# Altium schematic sheet 12V_9V_Power_Stage.SchDoc (part 3 of 4)
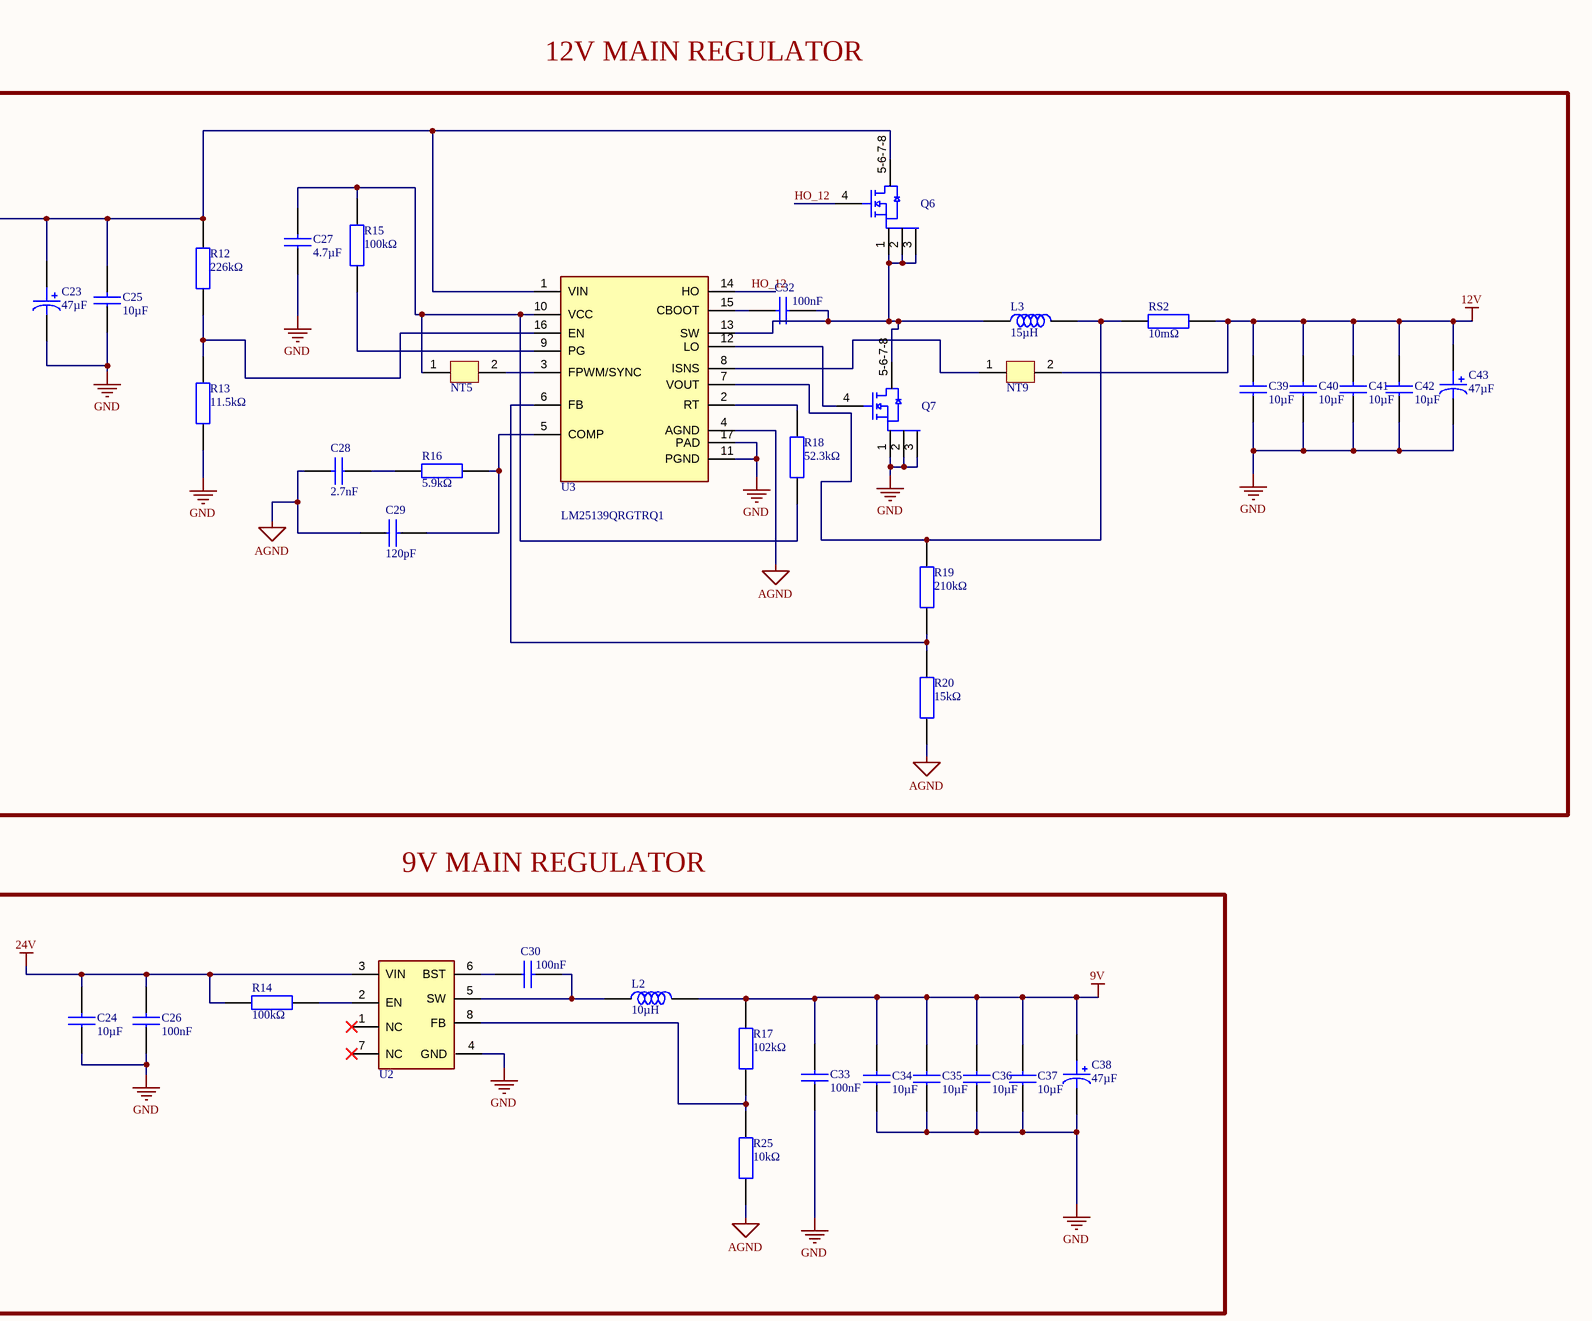
[diagram p3: 12V_9V_Power_Stage.SchDoc, right]

## Library data of the parts (continued)
R17 = CRCW0402102KFKED: 63mW Thick Film Resistors 75V ±1% ±100ppm/℃ 102kΩ 0402 Chip Resistor - Surface Mount ROHS; Manufacturer: Vishay; Temperature Coefficient: 100ppm/°C; Voltage Rating: 50V; Supplier: Farnell; Supplier Part Number: CRCW0402102KFKED; Manufacturer Part Number: CRCW0402102KFKED; RoHS: Compliant; Category: Chip SMD Resistors; Stock: 8240; Pricing: 10=0,0198, 100=0,0144, 500=0,0116, 2500=0,0096, 5000=0,0093, 10000=0,0089 (EUR); Case/Package: 0402; Case Code (Imperial): 0402; China RoHS: Non-Compliant; Composition: Thick Film; Contact Plating: Tin; Country of Origin: Israel, Taiwan; Depth: 500µm; Export Control Classification Number (ECCN) Code: EAR99; Features: Automotive AEC-Q200; Height: 350µm; Harmonized Tariff Schedule (HTS) Code: 8533.21.00.30; Introduction Date: 2005-03-24; Lead Free: Lead Free; Length: 1mm; Lifecycle Status: Production; Max Operating Temperature: 155°C; Max Power Dissipation: 63mW; Military Standard: Not; Min Operating Temperature: -55°C; Mounting Technology: Surface Mount; Pins: 2; Number of Terminals: 2; Number of Terminations: 2; Packaging: Cut Tape; Power Rating: 63mW; Radiation Hardening: No; Ratings: AEC-Q200; REACH SVHC: Yes; Schedule B: 8533210045, 8533210045|8533210045, 8533210045|8533210045|8533210045, 8533210045|8533210045|8533210045|8533210045; Termination: SMD/SMT; Tolerance: 1%; Voltage Rating (DC): 50V; Weight: 652.039032µg; Width: 500µm; Working Voltage: 50V; ComponentLink1URL: https://datasheet.octopart.com:443/CRCW0402102KFKED-Vishay-datasheet-175423584.pdf?src-supplier=IHS; ComponentLink1Description: https://datasheet.octopart.com:443/CRCW0402102KFKED-Vishay-datasheet-175423584.pdf?src-supplier=IHS; ComponentLink2URL: https://datasheet.octopart.com:443/CRCW0402102KFKED-Vishay-datasheet-190005712.pdf?src-supplier=TME; ComponentLink2Description: https://datasheet.octopart.com:443/CRCW0402102KFKED-Vishay-datasheet-190005712.pdf?src-supplier=TME; ComponentLink3URL: https://datasheet.octopart.com:443/CRCW0402102KFKED-Vishay-datasheet-66077789.pdf?src-supplier=Newark; ComponentLink3Description: https://datasheet.octopart.com:443/CRCW0402102KFKED-Vishay-datasheet-66077789.pdf?src-supplier=Newark; ComponentLink4URL: https://datasheet.octopart.com:443/CRCW0402102KFKED-Vishay-datasheet-11761042.pdf?src-supplier=Newark; ComponentLink4Description: https://datasheet.octopart.com:443/CRCW0402102KFKED-Vishay-datasheet-11761042.pdf?src-supplier=Newark; ComponentLink5URL: https://datasheet.octopart.com:443/CRCW0402102KFKED-Vishay-datasheet-11516975.pdf?src-supplier=Newark; ComponentLink5Description: https://datasheet.octopart.com:443/CRCW0402102KFKED-Vishay-datasheet-11516975.pdf?src-supplier=Newark; ComponentLink6URL: https://datasheet.octopart.com:443/CRCW0402102KFKED.-Vishay-datasheet-183883877.pdf?src-supplier=Newark; ComponentLink6Description: https://datasheet.octopart.com:443/CRCW0402102KFKED.-Vishay-datasheet-183883877.pdf?src-supplier=Newark; ComponentLink7URL: https://datasheet.octopart.com:443/CRCW0402102KFKED-Vishay-datasheet-159614168.pdf?src-supplier=Newark; ComponentLink7Description: https://datasheet.octopart.com:443/CRCW0402102KFKED-Vishay-datasheet-159614168.pdf?src-supplier=Newark; ComponentLink8URL: https://datasheet.octopart.com:443/CRCW0402102KFKED-Vishay-datasheet-41302739.pdf?src-supplier=Newark; ComponentLink8Description: https://datasheet.octopart.com:443/CRCW0402102KFKED-Vishay-datasheet-41302739.pdf?src-supplier=Newark; ComponentLink9URL: https://datasheet.octopart.com:443/CRCW0402102KFKED-Vishay-datasheet-33013972.pdf?src-supplier=Newark; ComponentLink9Description: https://datasheet.octopart.com:443/CRCW0402102KFKED-Vishay-datasheet-33013972.pdf?src-supplier=Newark; ComponentLink10URL: https://datasheet.octopart.com:443/CRCW0402102KFKED-Vishay-datasheet-21226360.pdf?src-supplier=Newark; ComponentLink10Description: https://datasheet.octopart.com:443/CRCW0402102KFKED-Vishay-datasheet-21226360.pdf?src-supplier=Newark; ComponentLink11URL: https://datasheet.octopart.com:443/CRCW0402102KFKED-Vishay-datasheet-62317936.pdf?src-supplier=Farnell; ComponentLink11Description: https://datasheet.octopart.com:443/CRCW0402102KFKED-Vishay-datasheet-62317936.pdf?src-supplier=Farnell; ComponentLink12URL: https://datasheet.octopart.com:443/CRCW0402102KFKED.-Vishay-datasheet-83961561.pdf?src-supplier=Farnell; ComponentLink12Description: https://datasheet.octopart.com:443/CRCW0402102KFKED.-Vishay-datasheet-83961561.pdf?src-supplier=Farnell; ComponentLink13URL: https://datasheet.octopart.com:443/CRCW0402102KFKED-Vishay-datasheet-14722531.pdf?src-supplier=element14+APAC; ComponentLink13Description: https://datasheet.octopart.com:443/CRCW0402102KFKED-Vishay-datasheet-14722531.pdf?src-supplier=element14+APAC; ComponentLink14URL: https://datasheet.octopart.com:443/CRCW0402102KFKED-Vishay-datasheet-62316122.pdf?src-supplier=Future+Electronics; ComponentLink14Description: https://datasheet.octopart.com:443/CRCW0402102KFKED-Vishay-datasheet-62316122.pdf?src-supplier=Future+Electronics; ComponentLink15URL: https://datasheet.octopart.com:443/CRCW0402102KFKED-Vishay-datasheet-12519820.pdf?src-supplier=Future+Electronics; ComponentLink15Description: https://datasheet.octopart.com:443/CRCW0402102KFKED-Vishay-datasheet-12519820.pdf?src-supplier=Future+Electronics; ComponentLink16URL: https://datasheet.octopart.com:443/CRCW0402102KFKED-Vishay-Dale-datasheet-47688880.pdf?src-supplier=RS+(Formerly+Allied+Electronics); ComponentLink16Description: https://datasheet.octopart.com:443/CRCW0402102KFKED-Vishay-Dale-datasheet-47688880.pdf?src-supplier=RS+(Formerly+Allied+Electronics); ComponentLink17URL: https://datasheet.octopart.com:443/CRCW0402102KFKED-Vishay-datasheet-12001583.pdf?src-supplier=RS+(Formerly+Allied+Electronics); ComponentLink17Description: https://datasheet.octopart.com:443/CRCW0402102KFKED-Vishay-datasheet-12001583.pdf?src-supplier=RS+(Formerly+Allied+Electronics); ComponentLink18URL: https://datasheet.octopart.com:443/CRCW0402102KFKED-Vishay-datasheet-5306405.pdf?src-supplier=RS+(Formerly+Allied+Electronics); ComponentLink18Description: https://datasheet.octopart.com:443/CRCW0402102KFKED-Vishay-datasheet-5306405.pdf?src-supplier=RS+(Formerly+Allied+Electronics); ComponentLink19URL: https://datasheet.octopart.com/D-CRCW-e3-Standard-Thick-Film-Chip-Resistors-Vishay-datasheet-family-64.pdf; ComponentLink19Description: https://datasheet.octopart.com/D-CRCW-e3-Standard-Thick-Film-Chip-Resistors-Vishay-datasheet-family-64.pdf; ComponentLink20URL: https://datasheet.octopart.com:443/CRCW0402102KFKED-Vishay-datasheet-11540273.pdf?src-supplier=Arrow+Electronics; ComponentLink20Description: https://datasheet.octopart.com:443/CRCW0402102KFKED-Vishay-datasheet-11540273.pdf?src-supplier=Arrow+Electronics; ComponentLink21URL: https://datasheet.octopart.com:443/CRCW0402102KFKED-Vishay-datasheet-8445837.pdf?src-supplier=element14; ComponentLink21Description: https://datasheet.octopart.com:443/CRCW0402102KFKED-Vishay-datasheet-8445837.pdf?src-supplier=element14; ComponentLink22URL: https://datasheet.octopart.com:443/CRCW0402102KFKED-Vishay-datasheet-5377255.pdf?src-supplier=Garrett; ComponentLink22Description: https://datasheet.octopart.com:443/CRCW0402102KFKED-Vishay-datasheet-5377255.pdf?src-supplier=Garrett; ComponentLink23URL: https://datasheet.octopart.com:443/CRCW0402102KFKED-Vishay-datasheet-148188.pdf?src-supplier=Garrett; ComponentLink23Description: https://datasheet.octopart.com:443/CRCW0402102KFKED-Vishay-datasheet-148188.pdf?src-supplier=Garrett; ComponentLink24URL: https://datasheet.octopart.com:443/CRCW0402102KFKED-Vishay-datasheet-42367.pdf?src-supplier=Garrett; ComponentLink24Description: https://datasheet.octopart.com:443/CRCW0402102KFKED-Vishay-datasheet-42367.pdf?src-supplier=Garrett; ComponentLink25URL: http://sigma.octopart.com:80/rohs_certificate/D-CRCW-e3-Standard-Thick-Film-Chip-Resistors-Vishay-family-102.pdf?src-supplier=Compliance+Statements; ComponentLink25Description: http://sigma.octopart.com:80/rohs_certificate/D-CRCW-e3-Standard-Thick-Film-Chip-Resistors-Vishay-family-102.pdf?src-supplier=Compliance+Statements
R18 = CRCW060352K3FKEA: 100mW Thick Film Resistors 75V ±1% ±100ppm/℃ 52.3kΩ 0603 Chip Resistor - Surface Mount ROHS; Manufacturer: Vishay; Temperature Coefficient: 100ppm/°C; Supplier: Farnell; Supplier Part Number: CRCW060352K3FKEA; Manufacturer Part Number: CRCW060352K3FKEA; RoHS: Compliant; Category: Chip SMD Resistors; Stock: 150000; Pricing: 5000=0,0098 (EUR); Case/Package: 0603; Case Code (Imperial): 0603; China RoHS: Non-Compliant; Composition: Thick Film; Contact Plating: Tin; Country of Origin: Israel, Taiwan; Depth: 850µm; Export Control Classification Number (ECCN) Code: EAR99; Features: Automotive AEC-Q200; Height: 450µm; Harmonized Tariff Schedule (HTS) Code: 8533.21.00.30; Introduction Date: 2005-02-16; Lead Free: Lead Free; Length: 1.55mm; Lifecycle Status: Production; Max Operating Temperature: 155°C; Max Power Dissipation: 100mW; Military Standard: Not; Min Operating Temperature: -55°C; Mounting Technology: Surface Mount; Pins: 2; Number of Terminals: 2; Number of Terminations: 2; Packaging: Cut Tape; Power Rating: 100mW; Radiation Hardening: No; Ratings: AEC-Q200; REACH SVHC: Yes; Schedule B: 8533210045, 8533210045|8533210045, 8533210045|8533210045|8533210045, 8533210045|8533210045|8533210045|8533210045; Termination: SMD/SMT; Tolerance: 1%; Voltage Rating: 75V; Weight: 2.012816mg; Width: 850µm; Working Voltage: 75V; ComponentLink1URL: https://datasheet.octopart.com:443/CRCW060352K3FKEA-Vishay-datasheet-175423584.pdf?src-supplier=IHS; ComponentLink1Description: https://datasheet.octopart.com:443/CRCW060352K3FKEA-Vishay-datasheet-175423584.pdf?src-supplier=IHS; ComponentLink2URL: https://datasheet.octopart.com:443/CRCW060352K3FKEA-Vishay-datasheet-62316122.pdf?src-supplier=Future+Electronics; ComponentLink2Description: https://datasheet.octopart.com:443/CRCW060352K3FKEA-Vishay-datasheet-62316122.pdf?src-supplier=Future+Electronics; ComponentLink3URL: https://datasheet.octopart.com:443/CRCW060352K3FKEA-Vishay-datasheet-5300368.pdf?src-supplier=Future+Electronics; ComponentLink3Description: https://datasheet.octopart.com:443/CRCW060352K3FKEA-Vishay-datasheet-5300368.pdf?src-supplier=Future+Electronics; ComponentLink4URL: https://datasheet.octopart.com:443/CRCW060352K3FKEA.-Vishay-datasheet-83961561.pdf?src-supplier=Newark; ComponentLink4Description: https://datasheet.octopart.com:443/CRCW060352K3FKEA.-Vishay-datasheet-83961561.pdf?src-supplier=Newark; ComponentLink5URL: https://datasheet.octopart.com:443/CRCW060352K3FKEA-Vishay-datasheet-66077789.pdf?src-supplier=Newark; ComponentLink5Description: https://datasheet.octopart.com:443/CRCW060352K3FKEA-Vishay-datasheet-66077789.pdf?src-supplier=Newark; ComponentLink6URL: https://datasheet.octopart.com:443/CRCW060352K3FKEA-Vishay-datasheet-11761042.pdf?src-supplier=Newark; ComponentLink6Description: https://datasheet.octopart.com:443/CRCW060352K3FKEA-Vishay-datasheet-11761042.pdf?src-supplier=Newark; ComponentLink7URL: https://datasheet.octopart.com:443/CRCW060352K3FKEA-Vishay-datasheet-11516975.pdf?src-supplier=Newark; ComponentLink7Description: https://datasheet.octopart.com:443/CRCW060352K3FKEA-Vishay-datasheet-11516975.pdf?src-supplier=Newark; ComponentLink8URL: https://datasheet.octopart.com:443/CRCW060352K3FKEA-Vishay-datasheet-159614168.pdf?src-supplier=Newark; ComponentLink8Description: https://datasheet.octopart.com:443/CRCW060352K3FKEA-Vishay-datasheet-159614168.pdf?src-supplier=Newark; ComponentLink9URL: https://datasheet.octopart.com:443/CRCW060352K3FKEA-Vishay-datasheet-33013972.pdf?src-supplier=Newark; ComponentLink9Description: https://datasheet.octopart.com:443/CRCW060352K3FKEA-Vishay-datasheet-33013972.pdf?src-supplier=Newark; ComponentLink10URL: https://datasheet.octopart.com:443/CRCW060352K3FKEA-Vishay-datasheet-21268114.pdf?src-supplier=Newark; ComponentLink10Description: https://datasheet.octopart.com:443/CRCW060352K3FKEA-Vishay-datasheet-21268114.pdf?src-supplier=Newark; ComponentLink11URL: https://datasheet.octopart.com:443/CRCW060352K3FKEA-Vishay-datasheet-21226360.pdf?src-supplier=Newark; ComponentLink11Description: https://datasheet.octopart.com:443/CRCW060352K3FKEA-Vishay-datasheet-21226360.pdf?src-supplier=Newark; ComponentLink12URL: https://datasheet.octopart.com:443/CRCW060352K3FKEA-Vishay-datasheet-62317937.pdf?src-supplier=element14+APAC; ComponentLink12Description: https://datasheet.octopart.com:443/CRCW060352K3FKEA-Vishay-datasheet-62317937.pdf?src-supplier=element14+APAC; ComponentLink13URL: https://datasheet.octopart.com:443/CRCW060352K3FKEA.-Vishay-datasheet-78776209.pdf?src-supplier=element14+APAC; ComponentLink13Description: https://datasheet.octopart.com:443/CRCW060352K3FKEA.-Vishay-datasheet-78776209.pdf?src-supplier=element14+APAC; ComponentLink14URL: https://datasheet.octopart.com:443/CRCW060352K3FKEA-Vishay-datasheet-14722531.pdf?src-supplier=element14+APAC; ComponentLink14Description: https://datasheet.octopart.com:443/CRCW060352K3FKEA-Vishay-datasheet-14722531.pdf?src-supplier=element14+APAC; ComponentLink15URL: https://datasheet.octopart.com:443/CRCW060352K3FKEA-Vishay-datasheet-5299586.pdf?src-supplier=element14+APAC; ComponentLink15Description: https://datasheet.octopart.com:443/CRCW060352K3FKEA-Vishay-datasheet-5299586.pdf?src-supplier=element14+APAC; ComponentLink16URL: https://datasheet.octopart.com:443/CRCW060352K3FKEA-Vishay-datasheet-10380026.pdf?src-supplier=element14+APAC; ComponentLink16Description: https://datasheet.octopart.com:443/CRCW060352K3FKEA-Vishay-datasheet-10380026.pdf?src-supplier=element14+APAC; ComponentLink17URL: https://datasheet.octopart.com:443/CRCW060352K3FKEA-Vishay-datasheet-137114422.pdf?src-supplier=X-ON; ComponentLink17Description: https://datasheet.octopart.com:443/CRCW060352K3FKEA-Vishay-datasheet-137114422.pdf?src-supplier=X-ON; ComponentLink18URL: https://datasheet.octopart.com:443/CRCW060352K3FKEA-Vishay-Dale-datasheet-47688880.pdf?src-supplier=RS+(Formerly+Allied+Electronics); ComponentLink18Description: https://datasheet.octopart.com:443/CRCW060352K3FKEA-Vishay-Dale-datasheet-47688880.pdf?src-supplier=RS+(Formerly+Allied+Electronics); ComponentLink19URL: https://datasheet.octopart.com:443/CRCW060352K3FKEA-Vishay-datasheet-12001583.pdf?src-supplier=RS+(Formerly+Allied+Electronics); ComponentLink19Description: https://datasheet.octopart.com:443/CRCW060352K3FKEA-Vishay-datasheet-12001583.pdf?src-supplier=RS+(Formerly+Allied+Electronics); ComponentLink20URL: https://datasheet.octopart.com:443/CRCW060352K3FKEA-Vishay-datasheet-5306405.pdf?src-supplier=RS+(Formerly+Allied+Electronics); ComponentLink20Description: https://datasheet.octopart.com:443/CRCW060352K3FKEA-Vishay-datasheet-5306405.pdf?src-supplier=RS+(Formerly+Allied+Electronics); ComponentLink21URL: https://datasheet.octopart.com:443/CRCW060352K3FKEA-Vishay-datasheet-8619608.pdf?src-supplier=element14; ComponentLink21Description: https://datasheet.octopart.com:443/CRCW060352K3FKEA-Vishay-datasheet-8619608.pdf?src-supplier=element14; ComponentLink22URL: https://datasheet.octopart.com:443/CRCW060352K3FKEA-Vishay-datasheet-5377433.pdf?src-supplier=Garrett; ComponentLink22Description: https://datasheet.octopart.com:443/CRCW060352K3FKEA-Vishay-datasheet-5377433.pdf?src-supplier=Garrett; ComponentLink23URL: https://datasheet.octopart.com:443/CRCW060352K3FKEA-Vishay-datasheet-148188.pdf?src-supplier=Garrett; ComponentLink23Description: https://datasheet.octopart.com:443/CRCW060352K3FKEA-Vishay-datasheet-148188.pdf?src-supplier=Garrett; ComponentLink24URL: https://datasheet.octopart.com:443/CRCW060352K3FKEA-Vishay-datasheet-30224.pdf?src-supplier=Garrett; ComponentLink24Description: https://datasheet.octopart.com:443/CRCW060352K3FKEA-Vishay-datasheet-30224.pdf?src-supplier=Garrett; ComponentLink25URL: http://sigma.octopart.com:80/rohs_statement/Vishay-company-15.pdf?src-supplier=Compliance+Statements; ComponentLink25Description: http://sigma.octopart.com:80/rohs_statement/Vishay-company-15.pdf?src-supplier=Compliance+Statements
R19 = CRCW0402210KFKED: 62.5mW Thick Film Resistors 50V ±1% ±100ppm/℃ 210kΩ 0402 Chip Resistor - Surface Mount ROHS; Manufacturer: Vishay; Power Rating: 63mW; Temperature Coefficient: 100ppm/°C; Supplier: Farnell; Supplier Part Number: CRCW0402210KFKED; Manufacturer Part Number: CRCW0402210KFKED; RoHS: Compliant; Category: Chip SMD Resistors; Stock: 20749; Pricing: 10=0,0193, 100=0,014, 500=0,0113, 2500=0,0094, 5000=0,0091, 10000=0,0087 (EUR); Case/Package: 0402; Case Code (Imperial): 0402; China RoHS: Non-Compliant; Composition: Thick Film; Contact Plating: Tin; Country of Origin: Israel, Taiwan; Depth: 500µm; Export Control Classification Number (ECCN) Code: EAR99; Height: 350µm; Harmonized Tariff Schedule (HTS) Code: 8533.21.00.30; Introduction Date: 2005-03-24; Lead Free: Lead Free; Length: 1mm; Lifecycle Status: Production; Max Operating Temperature: 155°C; Military Standard: Not; Min Operating Temperature: -55°C; Mounting Technology: Surface Mount; Pins: 2; Number of Terminals: 2; Packaging: Cut Tape; Ratings: AEC-Q200; REACH SVHC: Yes; Schedule B: 8533210045, 8533210045|8533210045, 8533210045|8533210045|8533210045, 8533210045|8533210045|8533210045|8533210045; Termination: SMD/SMT; Tolerance: 1%; Voltage Rating: 50V; Voltage Rating (DC): 50V; Weight: 652.039032µg; Width: 500µm; Working Voltage: 50V; ComponentLink1URL: https://datasheet.octopart.com:443/CRCW0402210KFKED-Vishay-datasheet-175423584.pdf?src-supplier=IHS; ComponentLink1Description: https://datasheet.octopart.com:443/CRCW0402210KFKED-Vishay-datasheet-175423584.pdf?src-supplier=IHS; ComponentLink2URL: https://datasheet.octopart.com:443/CRCW0402210KFKED-Vishay-datasheet-83961561.pdf?src-supplier=Newark; ComponentLink2Description: https://datasheet.octopart.com:443/CRCW0402210KFKED-Vishay-datasheet-83961561.pdf?src-supplier=Newark; ComponentLink3URL: https://datasheet.octopart.com:443/CRCW0402210KFKED-Vishay-datasheet-11761042.pdf?src-supplier=Newark; ComponentLink3Description: https://datasheet.octopart.com:443/CRCW0402210KFKED-Vishay-datasheet-11761042.pdf?src-supplier=Newark; ComponentLink4URL: https://datasheet.octopart.com:443/CRCW0402210KFKED-Vishay-datasheet-11516975.pdf?src-supplier=Newark; ComponentLink4Description: https://datasheet.octopart.com:443/CRCW0402210KFKED-Vishay-datasheet-11516975.pdf?src-supplier=Newark; ComponentLink5URL: https://datasheet.octopart.com:443/CRCW0402210KFKED-Vishay-datasheet-159614168.pdf?src-supplier=Newark; ComponentLink5Description: https://datasheet.octopart.com:443/CRCW0402210KFKED-Vishay-datasheet-159614168.pdf?src-supplier=Newark; ComponentLink6URL: https://datasheet.octopart.com:443/CRCW0402210KFKED-Vishay-datasheet-33013972.pdf?src-supplier=Newark; ComponentLink6Description: https://datasheet.octopart.com:443/CRCW0402210KFKED-Vishay-datasheet-33013972.pdf?src-supplier=Newark; ComponentLink7URL: https://datasheet.octopart.com:443/CRCW0402210KFKED-Vishay-datasheet-21268114.pdf?src-supplier=Newark; ComponentLink7Description: https://datasheet.octopart.com:443/CRCW0402210KFKED-Vishay-datasheet-21268114.pdf?src-supplier=Newark; ComponentLink8URL: https://datasheet.octopart.com:443/CRCW0402210KFKED-Vishay-datasheet-21226360.pdf?src-supplier=Newark; ComponentLink8Description: https://datasheet.octopart.com:443/CRCW0402210KFKED-Vishay-datasheet-21226360.pdf?src-supplier=Newark; ComponentLink9URL: https://datasheet.octopart.com:443/CRCW0402210KFKED-Vishay-datasheet-66077789.pdf?src-supplier=element14+APAC; ComponentLink9Description: https://datasheet.octopart.com:443/CRCW0402210KFKED-Vishay-datasheet-66077789.pdf?src-supplier=element14+APAC; ComponentLink10URL: https://datasheet.octopart.com:443/CRCW0402210KFKED-Vishay-datasheet-62317933.pdf?src-supplier=element14+APAC; ComponentLink10Description: https://datasheet.octopart.com:443/CRCW0402210KFKED-Vishay-datasheet-62317933.pdf?src-supplier=element14+APAC; ComponentLink11URL: https://datasheet.octopart.com:443/CRCW0402210KFKED.-Vishay-datasheet-78776209.pdf?src-supplier=element14+APAC; ComponentLink11Description: https://datasheet.octopart.com:443/CRCW0402210KFKED.-Vishay-datasheet-78776209.pdf?src-supplier=element14+APAC; ComponentLink12URL: https://datasheet.octopart.com:443/CRCW0402210KFKED-Vishay-datasheet-14722531.pdf?src-supplier=element14+APAC; ComponentLink12Description: https://datasheet.octopart.com:443/CRCW0402210KFKED-Vishay-datasheet-14722531.pdf?src-supplier=element14+APAC; ComponentLink13URL: https://datasheet.octopart.com:443/CRCW0402210KFKED-Vishay-datasheet-5299586.pdf?src-supplier=element14+APAC; ComponentLink13Description: https://datasheet.octopart.com:443/CRCW0402210KFKED-Vishay-datasheet-5299586.pdf?src-supplier=element14+APAC; ComponentLink14URL: https://datasheet.octopart.com:443/CRCW0402210KFKED-Vishay-datasheet-10380026.pdf?src-supplier=element14+APAC; ComponentLink14Description: https://datasheet.octopart.com:443/CRCW0402210KFKED-Vishay-datasheet-10380026.pdf?src-supplier=element14+APAC; ComponentLink15URL: https://datasheet.octopart.com:443/CRCW0402210KFKED-Vishay-datasheet-62316122.pdf?src-supplier=Future+Electronics; ComponentLink15Description: https://datasheet.octopart.com:443/CRCW0402210KFKED-Vishay-datasheet-62316122.pdf?src-supplier=Future+Electronics; ComponentLink16URL: https://datasheet.octopart.com:443/CRCW0402210KFKED-Vishay-datasheet-12543454.pdf?src-supplier=Future+Electronics; ComponentLink16Description: https://datasheet.octopart.com:443/CRCW0402210KFKED-Vishay-datasheet-12543454.pdf?src-supplier=Future+Electronics; ComponentLink17URL: https://datasheet.octopart.com:443/CRCW0402210KFKED-Vishay-Dale-datasheet-47688880.pdf?src-supplier=RS+(Formerly+Allied+Electronics); ComponentLink17Description: https://datasheet.octopart.com:443/CRCW0402210KFKED-Vishay-Dale-datasheet-47688880.pdf?src-supplier=RS+(Formerly+Allied+Electronics); ComponentLink18URL: https://datasheet.octopart.com:443/CRCW0402210KFKED-Vishay-datasheet-12001583.pdf?src-supplier=RS+(Formerly+Allied+Electronics); ComponentLink18Description: https://datasheet.octopart.com:443/CRCW0402210KFKED-Vishay-datasheet-12001583.pdf?src-supplier=RS+(Formerly+Allied+Electronics); ComponentLink19URL: https://datasheet.octopart.com:443/CRCW0402210KFKED-Vishay-datasheet-5306405.pdf?src-supplier=RS+(Formerly+Allied+Electronics); ComponentLink19Description: https://datasheet.octopart.com:443/CRCW0402210KFKED-Vishay-datasheet-5306405.pdf?src-supplier=RS+(Formerly+Allied+Electronics); ComponentLink20URL: https://datasheet.octopart.com:443/CRCW0402210KFKED-Vishay-datasheet-11540273.pdf?src-supplier=Arrow+Electronics; ComponentLink20Description: https://datasheet.octopart.com:443/CRCW0402210KFKED-Vishay-datasheet-11540273.pdf?src-supplier=Arrow+Electronics; ComponentLink21URL: https://datasheet.octopart.com:443/CRCW0402210KFKED-Vishay-datasheet-8445837.pdf?src-supplier=element14; ComponentLink21Description: https://datasheet.octopart.com:443/CRCW0402210KFKED-Vishay-datasheet-8445837.pdf?src-supplier=element14; ComponentLink22URL: https://datasheet.octopart.com:443/CRCW0402210KFKED-Vishay-datasheet-5377255.pdf?src-supplier=Garrett; ComponentLink22Description: https://datasheet.octopart.com:443/CRCW0402210KFKED-Vishay-datasheet-5377255.pdf?src-supplier=Garrett; ComponentLink23URL: https://datasheet.octopart.com:443/CRCW0402210KFKED-Vishay-datasheet-148188.pdf?src-supplier=Garrett; ComponentLink23Description: https://datasheet.octopart.com:443/CRCW0402210KFKED-Vishay-datasheet-148188.pdf?src-supplier=Garrett; ComponentLink24URL: https://datasheet.octopart.com:443/CRCW0402210KFKED-Vishay-datasheet-42367.pdf?src-supplier=Garrett; ComponentLink24Description: https://datasheet.octopart.com:443/CRCW0402210KFKED-Vishay-datasheet-42367.pdf?src-supplier=Garrett; ComponentLink25URL: http://sigma.octopart.com:80/rohs_statement/Vishay-company-15.pdf?src-supplier=Compliance+Statements; ComponentLink25Description: http://sigma.octopart.com:80/rohs_statement/Vishay-company-15.pdf?src-supplier=Compliance+Statements
R20 = CRCW040215K0FKED: Res Thick Film 0402 15K Ohm 1% 1/16W ±100ppm/°C Molded SMD Paper T/R; Manufacturer: Vishay; Max Power Dissipation: 63mW; Voltage Rating: 50V; Supplier: Farnell; Supplier Part Number: CRCW040215K0FKED; Manufacturer Part Number: CRCW040215K0FKED; RoHS: Compliant; Category: Chip SMD Resistors; Stock: 425572; Pricing: 10=0,0138, 100=0,013, 500=0,0086, 2500=0,0078, 5000=0,0061, 10000=0,0051 (EUR); Case/Package: 0402; Case Code (Imperial): 0402; China RoHS: Non-Compliant; Composition: Thick Film; Contact Plating: Tin; Depth: 500µm; Features: Automotive AEC-Q200; Height: 350µm; Lead Free: Lead Free; Length: 1mm; Lifecycle Status: Production; Max Operating Temperature: 155°C; Military Standard: Not; Min Operating Temperature: -55°C; Mounting Technology: Surface Mount; Pins: 2; Number of Terminals: 2; Number of Terminations: 2; Packaging: Cut Tape; Power Rating: 63mW; Radiation Hardening: No; Ratings: AEC-Q200; REACH SVHC: Yes; Schedule B: 8533210045, 8533210045|8533210045|8533210045|8533210045|8533210045|8533210045|8533210045|8533210045|8533210045, 8533210045|8533210045|8533210045|8533210045|8533210045|8533210045|8533210045|8533210045|8533210045|8533210045, 8533210045|8533210045|8533210045|8533210045|8533210045|8533210045|8533210045|8533210045|8533210045|8533210045|8533210045; Temperature Coefficient: 100ppm/°C; Termination: SMD/SMT; Tolerance: 1%; Voltage Rating (DC): 50V; Weight: 652.039032µg; Width: 500µm; Working Voltage: 50V; ComponentLink1URL: https://datasheet.octopart.com:443/CRCW040215K0FKED-Vishay-datasheet-175423584.pdf?src-supplier=IHS; ComponentLink1Description: https://datasheet.octopart.com:443/CRCW040215K0FKED-Vishay-datasheet-175423584.pdf?src-supplier=IHS; ComponentLink2URL: https://datasheet.octopart.com:443/CRCW040215K0FKED-Vishay-datasheet-5300368.pdf?src-supplier=Future+Electronics; ComponentLink2Description: https://datasheet.octopart.com:443/CRCW040215K0FKED-Vishay-datasheet-5300368.pdf?src-supplier=Future+Electronics; ComponentLink3URL: https://datasheet.octopart.com:443/CRCW040215K0FKED-Vishay-datasheet-62316122.pdf?src-supplier=Future+Electronics; ComponentLink3Description: https://datasheet.octopart.com:443/CRCW040215K0FKED-Vishay-datasheet-62316122.pdf?src-supplier=Future+Electronics; ComponentLink4URL: https://datasheet.octopart.com:443/CRCW040215K0FKED-Vishay-datasheet-83961561.pdf?src-supplier=Newark; ComponentLink4Description: https://datasheet.octopart.com:443/CRCW040215K0FKED-Vishay-datasheet-83961561.pdf?src-supplier=Newark; ComponentLink5URL: https://datasheet.octopart.com:443/CRCW040215K0FKED-Vishay-datasheet-11516975.pdf?src-supplier=Newark; ComponentLink5Description: https://datasheet.octopart.com:443/CRCW040215K0FKED-Vishay-datasheet-11516975.pdf?src-supplier=Newark; ComponentLink6URL: https://datasheet.octopart.com:443/CRCW040215K0FKED-Vishay-datasheet-41302739.pdf?src-supplier=Newark; ComponentLink6Description: https://datasheet.octopart.com:443/CRCW040215K0FKED-Vishay-datasheet-41302739.pdf?src-supplier=Newark; ComponentLink7URL: https://datasheet.octopart.com:443/CRCW040215K0FKED-Vishay-datasheet-33013972.pdf?src-supplier=Newark; ComponentLink7Description: https://datasheet.octopart.com:443/CRCW040215K0FKED-Vishay-datasheet-33013972.pdf?src-supplier=Newark; ComponentLink8URL: https://datasheet.octopart.com:443/CRCW040215K0FKED-Vishay-datasheet-21226360.pdf?src-supplier=Newark; ComponentLink8Description: https://datasheet.octopart.com:443/CRCW040215K0FKED-Vishay-datasheet-21226360.pdf?src-supplier=Newark; ComponentLink9URL: https://datasheet.octopart.com:443/CRCW040215K0FKED-Vishay-datasheet-62317933.pdf?src-supplier=element14+APAC; ComponentLink9Description: https://datasheet.octopart.com:443/CRCW040215K0FKED-Vishay-datasheet-62317933.pdf?src-supplier=element14+APAC; ComponentLink10URL: https://datasheet.octopart.com:443/CRCW040215K0FKED-Vishay-datasheet-14722531.pdf?src-supplier=element14+APAC; ComponentLink10Description: https://datasheet.octopart.com:443/CRCW040215K0FKED-Vishay-datasheet-14722531.pdf?src-supplier=element14+APAC; ComponentLink11URL: https://datasheet.octopart.com:443/CRCW040215K0FKED.-Vishay-datasheet-78776209.pdf?src-supplier=element14+APAC; ComponentLink11Description: https://datasheet.octopart.com:443/CRCW040215K0FKED.-Vishay-datasheet-78776209.pdf?src-supplier=element14+APAC; ComponentLink12URL: https://datasheet.octopart.com:443/CRCW040215K0FKED-Vishay-datasheet-66077789.pdf?src-supplier=element14+APAC; ComponentLink12Description: https://datasheet.octopart.com:443/CRCW040215K0FKED-Vishay-datasheet-66077789.pdf?src-supplier=element14+APAC; ComponentLink13URL: https://datasheet.octopart.com:443/CRCW040215K0FKED-Vishay-datasheet-5306405.pdf?src-supplier=RS+(Formerly+Allied+Electronics); ComponentLink13Description: https://datasheet.octopart.com:443/CRCW040215K0FKED-Vishay-datasheet-5306405.pdf?src-supplier=RS+(Formerly+Allied+Electronics); ComponentLink14URL: https://datasheet.octopart.com:443/CRCW040215K0FKED-Vishay-Dale-datasheet-47688880.pdf?src-supplier=RS+(Formerly+Allied+Electronics); ComponentLink14Description: https://datasheet.octopart.com:443/CRCW040215K0FKED-Vishay-Dale-datasheet-47688880.pdf?src-supplier=RS+(Formerly+Allied+Electronics); ComponentLink15URL: https://datasheet.octopart.com:443/CRCW040215K0FKED-Vishay-datasheet-12001583.pdf?src-supplier=RS+(Formerly+Allied+Electronics); ComponentLink15Description: https://datasheet.octopart.com:443/CRCW040215K0FKED-Vishay-datasheet-12001583.pdf?src-supplier=RS+(Formerly+Allied+Electronics); ComponentLink16URL: https://datasheet.octopart.com:443/CRCW040215K0FKED-Vishay-datasheet-192322388.pdf?src-supplier=HQonline; ComponentLink16Description: https://datasheet.octopart.com:443/CRCW040215K0FKED-Vishay-datasheet-192322388.pdf?src-supplier=HQonline; ComponentLink17URL: https://datasheet.octopart.com:443/CRCW040215K0FKED-Vishay-datasheet-62332075.pdf?src-supplier=TME; ComponentLink17Description: https://datasheet.octopart.com:443/CRCW040215K0FKED-Vishay-datasheet-62332075.pdf?src-supplier=TME; ComponentLink18URL: https://datasheet.octopart.com/D-CRCW-e3-Standard-Thick-Film-Chip-Resistors-Vishay-datasheet-family-64.pdf; ComponentLink18Description: https://datasheet.octopart.com/D-CRCW-e3-Standard-Thick-Film-Chip-Resistors-Vishay-datasheet-family-64.pdf; ComponentLink19URL: https://datasheet.octopart.com:443/CRCW040215K0FKED-Vishay-datasheet-13242068.pdf?src-supplier=Farnell; ComponentLink19Description: https://datasheet.octopart.com:443/CRCW040215K0FKED-Vishay-datasheet-13242068.pdf?src-supplier=Farnell; ComponentLink20URL: https://datasheet.octopart.com:443/CRCW040215K0FKED-Vishay-datasheet-13195083.pdf?src-supplier=Farnell; ComponentLink20Description: https://datasheet.octopart.com:443/CRCW040215K0FKED-Vishay-datasheet-13195083.pdf?src-supplier=Farnell; ComponentLink21URL: https://datasheet.octopart.com:443/CRCW040215K0FKED-Vishay-datasheet-13034211.pdf?src-supplier=Farnell; ComponentLink21Description: https://datasheet.octopart.com:443/CRCW040215K0FKED-Vishay-datasheet-13034211.pdf?src-supplier=Farnell; ComponentLink22URL: https://datasheet.octopart.com:443/CRCW040215K0FKED-Vishay-datasheet-12600034.pdf?src-supplier=Farnell; ComponentLink22Description: https://datasheet.octopart.com:443/CRCW040215K0FKED-Vishay-datasheet-12600034.pdf?src-supplier=Farnell; ComponentLink23URL: https://datasheet.octopart.com:443/CRCW040215K0FKED-Vishay-datasheet-12532161.pdf?src-supplier=Farnell; ComponentLink23Description: https://datasheet.octopart.com:443/CRCW040215K0FKED-Vishay-datasheet-12532161.pdf?src-supplier=Farnell; ComponentLink24URL: https://datasheet.octopart.com:443/CRCW040215K0FKED-Vishay-datasheet-12517896.pdf?src-supplier=Farnell; ComponentLink24Description: https://datasheet.octopart.com:443/CRCW040215K0FKED-Vishay-datasheet-12517896.pdf?src-supplier=Farnell; ComponentLink25URL: https://datasheet.octopart.com:443/CRCW040215K0FKED-Vishay-datasheet-12509762.pdf?src-supplier=Farnell; ComponentLink25Description: https://datasheet.octopart.com:443/CRCW040215K0FKED-Vishay-datasheet-12509762.pdf?src-supplier=Farnell; ComponentLink26URL: https://datasheet.octopart.com:443/CRCW040215K0FKED-Vishay-datasheet-10322335.pdf?src-supplier=Farnell; ComponentLink26Description: https://datasheet.octopart.com:443/CRCW040215K0FKED-Vishay-datasheet-10322335.pdf?src-supplier=Farnell; ComponentLink27URL: https://datasheet.octopart.com:443/CRCW040215K0FKED-Vishay-datasheet-8788789.pdf?src-supplier=Farnell; ComponentLink27Description: https://datasheet.octopart.com:443/CRCW040215K0FKED-Vishay-datasheet-8788789.pdf?src-supplier=Farnell; ComponentLink28URL: https://datasheet.octopart.com:443/CRCW040215K0FKED-Vishay-datasheet-8361388.pdf?src-supplier=Farnell; ComponentLink28Description: https://datasheet.octopart.com:443/CRCW040215K0FKED-Vishay-datasheet-8361388.pdf?src-supplier=Farnell; ComponentLink29URL: https://datasheet.octopart.com:443/CRCW040215K0FKED-Vishay-datasheet-546287.pdf?src-supplier=Farnell; ComponentLink29Description: https://datasheet.octopart.com:443/CRCW040215K0FKED-Vishay-datasheet-546287.pdf?src-supplier=Farnell; ComponentLink30URL: https://datasheet.octopart.com:443/CRCW040215K0FKED-Vishay-datasheet-8699723.pdf?src-supplier=element14; ComponentLink30Description: https://datasheet.octopart.com:443/CRCW040215K0FKED-Vishay-datasheet-8699723.pdf?src-supplier=element14; ComponentLink31URL: https://datasheet.octopart.com:443/CRCW040215K0FKED-Vishay-datasheet-5377255.pdf?src-supplier=Garrett; ComponentLink31Description: https://datasheet.octopart.com:443/CRCW040215K0FKED-Vishay-datasheet-5377255.pdf?src-supplier=Garrett; ComponentLink32URL: https://datasheet.octopart.com:443/CRCW040215K0FKED-Vishay-datasheet-148188.pdf?src-supplier=Garrett; ComponentLink32Description: https://datasheet.octopart.com:443/CRCW040215K0FKED-Vishay-datasheet-148188.pdf?src-supplier=Garrett; ComponentLink33URL: https://datasheet.octopart.com:443/CRCW040215K0FKED-Vishay-datasheet-42367.pdf?src-supplier=Garrett; ComponentLink33Description: https://datasheet.octopart.com:443/CRCW040215K0FKED-Vishay-datasheet-42367.pdf?src-supplier=Garrett; ComponentLink34URL: http://sigma.octopart.com:80/rohs_certificate/D-CRCW-e3-Standard-Thick-Film-Chip-Resistors-Vishay-family-102.pdf?src-supplier=Compliance+Statements; ComponentLink34Description: http://sigma.octopart.com:80/rohs_certificate/D-CRCW-e3-Standard-Thick-Film-Chip-Resistors-Vishay-family-102.pdf?src-supplier=Compliance+Statements
R25 = CRCW040210K0FKED: Res Thick Film 0402 10K Ohm 1% 0.2W ±100ppm/°C Molded SMD SMD Paper T/R; Manufacturer: Vishay; Manufacturer Part Number: CRCW040210K0FKEDHP; Manufacturer Package Identifier: CRCW0402-HPe3; Power Rating: 200mW; Voltage Rating: 50V; Supplier: Farnell; Supplier Part Number: CRCW040210K0FKEDHP; RoHS: Compliant; Category: Chip SMD Resistors; Stock: 325662; Pricing: 10=0,0294, 100=0,0251, 500=0,0173, 2500=0,0156, 5000=0,0121 (EUR); Case/Package: 0402; Case Code (Imperial): 0402; Case Code (Metric): 1005; China RoHS: Non-Compliant; Composition: Thick Film; Contact Plating: Tin; Country of Origin: Israel, Mainland China; Depth: 500µm; Export Control Classification Number (ECCN) Code: EAR99; Height: 300µm; Harmonized Tariff Schedule (HTS) Code: 8533.21.00.30; Introduction Date: 2008-07-29; Lead Free: Lead Free; Length: 1mm; Lifecycle Status: Production; Max Operating Temperature: 155°C; Military Standard: Not; Min Operating Temperature: -55°C; Mounting Technology: Surface Mount; Pins: 2; Number of Terminals: 2; Packaging: Cut Tape; Radiation Hardening: No; Ratings: AEC-Q200; REACH SVHC: Yes; Schedule B: 8533210045; Temperature Coefficient: 100ppm/°C; Termination: SMD/SMT; Tolerance: 1%; Voltage Rating (DC): 50V; Weight: 652.039032µg; Width: 500µm; Working Voltage: 50V; ComponentLink1URL: https://datasheet.octopart.com/CRCW040210K0FKEDHP-Vishay-datasheet-83567917.pdf; ComponentLink1Description: https://datasheet.octopart.com/CRCW040210K0FKEDHP-Vishay-datasheet-83567917.pdf; ComponentLink2URL: https://datasheet.octopart.com/D-CRCW-e3-Standard-Thick-Film-Chip-Resistors-Vishay-datasheet-family-64.pdf; ComponentLink2Description: https://datasheet.octopart.com/D-CRCW-e3-Standard-Thick-Film-Chip-Resistors-Vishay-datasheet-family-64.pdf; ComponentLink3URL: https://datasheet.octopart.com:443/CRCW040210K0FKEDHP-Vishay-datasheet-13148866.pdf?src-supplier=Newark; ComponentLink3Description: https://datasheet.octopart.com:443/CRCW040210K0FKEDHP-Vishay-datasheet-13148866.pdf?src-supplier=Newark; ComponentLink4URL: https://datasheet.octopart.com:443/CRCW040210K0FKEDHP-Vishay-datasheet-13131392.pdf?src-supplier=Newark; ComponentLink4Description: https://datasheet.octopart.com:443/CRCW040210K0FKEDHP-Vishay-datasheet-13131392.pdf?src-supplier=Newark; ComponentLink5URL: https://datasheet.octopart.com:443/CRCW040210K0FKEDHP-Vishay-datasheet-12593106.pdf?src-supplier=Newark; ComponentLink5Description: https://datasheet.octopart.com:443/CRCW040210K0FKEDHP-Vishay-datasheet-12593106.pdf?src-supplier=Newark; ComponentLink6URL: https://datasheet.octopart.com:443/CRCW040210K0FKEDHP-Vishay-datasheet-12544674.pdf?src-supplier=Newark; ComponentLink6Description: https://datasheet.octopart.com:443/CRCW040210K0FKEDHP-Vishay-datasheet-12544674.pdf?src-supplier=Newark; ComponentLink7URL: https://datasheet.octopart.com:443/CRCW040210K0FKEDHP-Vishay-datasheet-12531795.pdf?src-supplier=Newark; ComponentLink7Description: https://datasheet.octopart.com:443/CRCW040210K0FKEDHP-Vishay-datasheet-12531795.pdf?src-supplier=Newark; ComponentLink8URL: https://datasheet.octopart.com:443/CRCW040210K0FKEDHP-Vishay-datasheet-12518686.pdf?src-supplier=Newark; ComponentLink8Description: https://datasheet.octopart.com:443/CRCW040210K0FKEDHP-Vishay-datasheet-12518686.pdf?src-supplier=Newark; ComponentLink9URL: https://datasheet.octopart.com:443/CRCW040210K0FKEDHP-Vishay-datasheet-12509906.pdf?src-supplier=Newark; ComponentLink9Description: https://datasheet.octopart.com:443/CRCW040210K0FKEDHP-Vishay-datasheet-12509906.pdf?src-supplier=Newark; ComponentLink10URL: https://datasheet.octopart.com:443/CRCW040210K0FKEDHP-Vishay-datasheet-10669844.pdf?src-supplier=Newark; ComponentLink10Description: https://datasheet.octopart.com:443/CRCW040210K0FKEDHP-Vishay-datasheet-10669844.pdf?src-supplier=Newark; ComponentLink11URL: https://datasheet.octopart.com:443/CRCW040210K0FKEDHP-Vishay-datasheet-8703221.pdf?src-supplier=Newark; ComponentLink11Description: https://datasheet.octopart.com:443/CRCW040210K0FKEDHP-Vishay-datasheet-8703221.pdf?src-supplier=Newark; ComponentLink12URL: https://datasheet.octopart.com:443/CRCW040210K0FKEDHP.-Vishay-datasheet-78776210.pdf?src-supplier=Newark; ComponentLink12Description: https://datasheet.octopart.com:443/CRCW040210K0FKEDHP.-Vishay-datasheet-78776210.pdf?src-supplier=Newark; ComponentLink13URL: https://datasheet.octopart.com:443/CRCW040210K0FKEDHP-Vishay-datasheet-21268118.pdf?src-supplier=Newark; ComponentLink13Description: https://datasheet.octopart.com:443/CRCW040210K0FKEDHP-Vishay-datasheet-21268118.pdf?src-supplier=Newark; ComponentLink14URL: https://datasheet.octopart.com:443/CRCW040210K0FKEDHP-Vishay-datasheet-21226360.pdf?src-supplier=Newark; ComponentLink14Description: https://datasheet.octopart.com:443/CRCW040210K0FKEDHP-Vishay-datasheet-21226360.pdf?src-supplier=Newark; ComponentLink15URL: https://datasheet.octopart.com:443/CRCW040210K0FKEDHP-Vishay-Draloric-datasheet-8359436.pdf?src-supplier=Newark; ComponentLink15Description: https://datasheet.octopart.com:443/CRCW040210K0FKEDHP-Vishay-Draloric-datasheet-8359436.pdf?src-supplier=Newark; ComponentLink16URL: https://datasheet.octopart.com:443/CRCW040210K0FKEDHP-Vishay-datasheet-87136057.pdf?src-supplier=Farnell; ComponentLink16Description: https://datasheet.octopart.com:443/CRCW040210K0FKEDHP-Vishay-datasheet-87136057.pdf?src-supplier=Farnell; ComponentLink17URL: https://datasheet.octopart.com:443/CRCW040210K0FKEDHP-Vishay-datasheet-37143532.pdf?src-supplier=Farnell; ComponentLink17Description: https://datasheet.octopart.com:443/CRCW040210K0FKEDHP-Vishay-datasheet-37143532.pdf?src-supplier=Farnell; ComponentLink18URL: https://datasheet.octopart.com:443/CRCW040210K0FKEDHP-Vishay-datasheet-41195455.pdf?src-supplier=Farnell; ComponentLink18Description: https://datasheet.octopart.com:443/CRCW040210K0FKEDHP-Vishay-datasheet-41195455.pdf?src-supplier=Farnell; ComponentLink19URL: https://datasheet.octopart.com:443/CRCW040210K0FKEDHP.-Vishay-datasheet-66581887.pdf?src-supplier=Farnell; ComponentLink19Description: https://datasheet.octopart.com:443/CRCW040210K0FKEDHP.-Vishay-datasheet-66581887.pdf?src-supplier=Farnell; ComponentLink20URL: https://datasheet.octopart.com:443/CRCW040210K0FKEDHP-Vishay-datasheet-62317933.pdf?src-supplier=element14+APAC; ComponentLink20Description: https://datasheet.octopart.com:443/CRCW040210K0FKEDHP-Vishay-datasheet-62317933.pdf?src-supplier=element14+APAC; ComponentLink21URL: https://datasheet.octopart.com:443/CRCW040210K0FKEDHP-Vishay-Dale-datasheet-41169523.pdf?src-supplier=element14+APAC; ComponentLink21Description: https://datasheet.octopart.com:443/CRCW040210K0FKEDHP-Vishay-Dale-datasheet-41169523.pdf?src-supplier=element14+APAC; ComponentLink22URL: https://datasheet.octopart.com:443/CRCW040210K0FKEDHP-Vishay-datasheet-192322387.pdf?src-supplier=HQonline; ComponentLink22Description: https://datasheet.octopart.com:443/CRCW040210K0FKEDHP-Vishay-datasheet-192322387.pdf?src-supplier=HQonline; ComponentLink23URL: https://datasheet.octopart.com:443/CRCW040210K0FKEDHP-Vishay-datasheet-62316122.pdf?src-supplier=Future+Electronics; ComponentLink23Description: https://datasheet.octopart.com:443/CRCW040210K0FKEDHP-Vishay-datasheet-62316122.pdf?src-supplier=Future+Electronics; ComponentLink24URL: https://datasheet.octopart.com:443/CRCW040210K0FKEDHP-Vishay-Dale-datasheet-47688881.pdf?src-supplier=RS+(Formerly+Allied+Electronics); ComponentLink24Description: https://datasheet.octopart.com:443/CRCW040210K0FKEDHP-Vishay-Dale-datasheet-47688881.pdf?src-supplier=RS+(Formerly+Allied+Electronics); ComponentLink25URL: https://datasheet.octopart.com:443/CRCW040210K0FKEDHP-Vishay-datasheet-11548710.pdf?src-supplier=Arrow+Electronics; ComponentLink25Description: https://datasheet.octopart.com:443/CRCW040210K0FKEDHP-Vishay-datasheet-11548710.pdf?src-supplier=Arrow+Electronics; ComponentLink26URL: http://sigma.octopart.com:80/rohs_certificate/D-CRCW-e3-Standard-Thick-Film-Chip-Resistors-Vishay-family-102.pdf?src-supplier=Compliance+Statements; ComponentLink26Description: http://sigma.octopart.com:80/rohs_certificate/D-CRCW-e3-Standard-Thick-Film-Chip-Resistors-Vishay-family-102.pdf?src-supplier=Compliance+Statements
RS2 = CSR1206FK10L0: Res Thick Film 1206 0.01 Ohm 1% 1/2W Molded SMD Paper T/R; Manufacturer: Stackpole Electronics; Max Power Dissipation: 500mW; Temperature Coefficient: 100ppm/°C; Working Voltage: 70.7mV; Supplier: Avnet; Supplier Part Number: CSR1206FK10L0; Manufacturer Part Number: CSR1206FK10L0; RoHS: Compliant; Category: Chip SMD Resistors; Stock: 53000; Pricing: 1000=0,102, 2000=0,1005, 4000=0,099, 8000=0,0975, 16000=0,096 (USD); Case/Package: 1206; Case Code (Imperial): 1206; Case Code (Metric): 3216; Composition: Thick Film; Contact Plating: Tin; Depth: 1.55mm; Height: 550µm; Lead Free: Lead Free; Length: 3.05mm; Lifecycle Status: Production; Max Operating Temperature: 155°C; Military Standard: Not; Min Operating Temperature: -55°C; Mounting Technology: Surface Mount; Number of Terminals: 2; Number of Terminations: 2; Packaging: Cut Tape (CT); Power Rating: 500mW; Radiation Hardening: No; REACH SVHC: Yes; Schedule B: 8533210045, 8533210045|8533210045, 8533210045|8533210045|8533210045, 8533210045|8533210045|8533210045|8533210045; Tolerance: 1%; Width: 1.55mm; ComponentLink1URL: https://datasheet.octopart.com:443/CSR1206FK10L0-Stackpole-Electronics-datasheet-170576569.pdf?src-supplier=IHS; ComponentLink1Description: https://datasheet.octopart.com:443/CSR1206FK10L0-Stackpole-Electronics-datasheet-170576569.pdf?src-supplier=IHS; ComponentLink2URL: https://datasheet.octopart.com:443/CSR1206FK10L0-Stackpole-Electronics-datasheet-12549637.pdf?src-supplier=Upverter; ComponentLink2Description: https://datasheet.octopart.com:443/CSR1206FK10L0-Stackpole-Electronics-datasheet-12549637.pdf?src-supplier=Upverter; ComponentLink3URL: https://datasheet.octopart.com:443/CSR1206FK10L0-Stackpole-Electronics-datasheet-12522144.pdf?src-supplier=Upverter; ComponentLink3Description: https://datasheet.octopart.com:443/CSR1206FK10L0-Stackpole-Electronics-datasheet-12522144.pdf?src-supplier=Upverter; ComponentLink4URL: https://datasheet.octopart.com:443/CSR1206FK10L0-Stackpole-Electronics-datasheet-141193797.pdf?src-supplier=Master+Electronics; ComponentLink4Description: https://datasheet.octopart.com:443/CSR1206FK10L0-Stackpole-Electronics-datasheet-141193797.pdf?src-supplier=Master+Electronics; ComponentLink5URL: https://datasheet.octopart.com:443/CSR1206FK10L0-Stackpole-Electronics-datasheet-10788265.pdf?src-supplier=Future+Electronics; ComponentLink5Description: https://datasheet.octopart.com:443/CSR1206FK10L0-Stackpole-Electronics-datasheet-10788265.pdf?src-supplier=Future+Electronics; ComponentLink6URL: https://datasheet.octopart.com:443/CSR1206FK10L0-Stackpole-Electronics-datasheet-130008997.pdf?src-supplier=Future+Electronics; ComponentLink6Description: https://datasheet.octopart.com:443/CSR1206FK10L0-Stackpole-Electronics-datasheet-130008997.pdf?src-supplier=Future+Electronics; ComponentLink7URL: https://datasheet.octopart.com:443/CSR1206FK10L0-Stackpole-Electronics-datasheet-5395846.pdf?src-supplier=Future+Electronics; ComponentLink7Description: https://datasheet.octopart.com:443/CSR1206FK10L0-Stackpole-Electronics-datasheet-5395846.pdf?src-supplier=Future+Electronics; ComponentLink8URL: https://datasheet.octopart.com:443/CSR1206FK10L0-Stackpole-Electronics-datasheet-608071.pdf?src-supplier=Stackpole+Electronics; ComponentLink8Description: https://datasheet.octopart.com:443/CSR1206FK10L0-Stackpole-Electronics-datasheet-608071.pdf?src-supplier=Stackpole+Electronics; ComponentLink9URL: https://datasheet.octopart.com:443/CSR1206FK10L0-Stackpole-Electronics-datasheet-11781806.pdf?src-supplier=Arrow+Electronics; ComponentLink9Description: https://datasheet.octopart.com:443/CSR1206FK10L0-Stackpole-Electronics-datasheet-11781806.pdf?src-supplier=Arrow+Electronics; ComponentLink10URL: http://sigma.octopart.com:80/15940493/materials_sheet/Stackpole-Electronics-CSR1206FK10L0.pdf?src-supplier=Compliance+Statements; ComponentLink10Description: http://sigma.octopart.com:80/15940493/materials_sheet/Stackpole-Electronics-CSR1206FK10L0.pdf?src-supplier=Compliance+Statements; ComponentLink11URL: http://sigma.octopart.com:80/141158212/rohs_statement/Stackpole-Electronics-CSR1206FK10L0.pdf?src-supplier=Compliance+Statements; ComponentLink11Description: http://sigma.octopart.com:80/141158212/rohs_statement/Stackpole-Electronics-CSR1206FK10L0.pdf?src-supplier=Compliance+Statements; ComponentLink12URL: http://sigma.octopart.com:80/141158211/reach_statement/Stackpole-Electronics-CSR1206FK10L0.pdf?src-supplier=Compliance+Statements; ComponentLink12Description: http://sigma.octopart.com:80/141158211/reach_statement/Stackpole-Electronics-CSR1206FK10L0.pdf?src-supplier=Compliance+Statements